# EAGLE design WideFeatherWing (EAGLE 7.4.0)
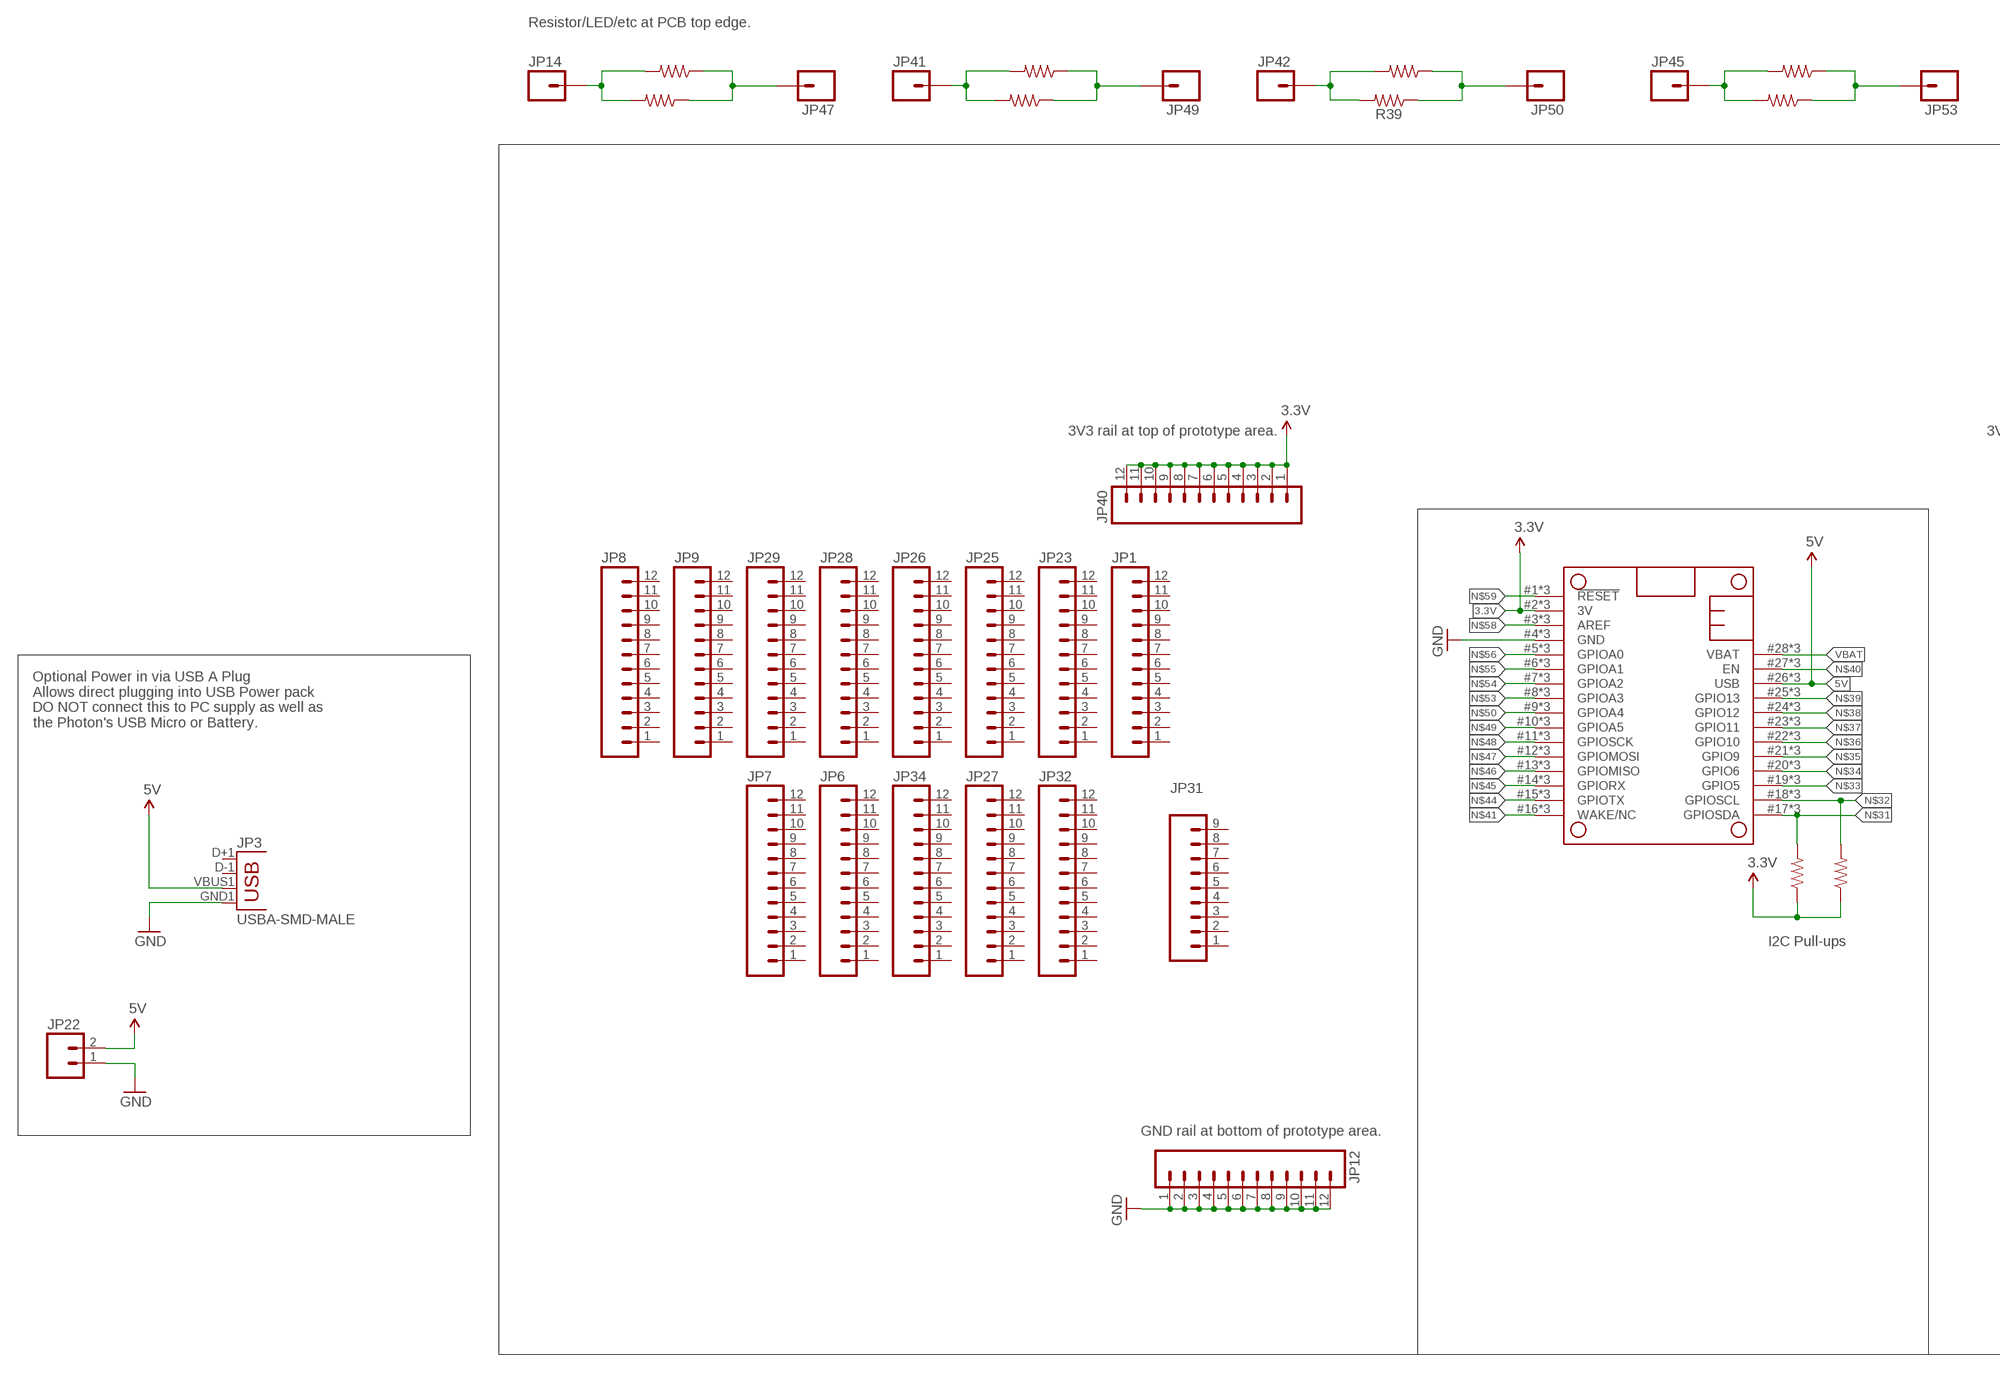
[diagram p0: schematic, sheet 1, part 1 of 2]
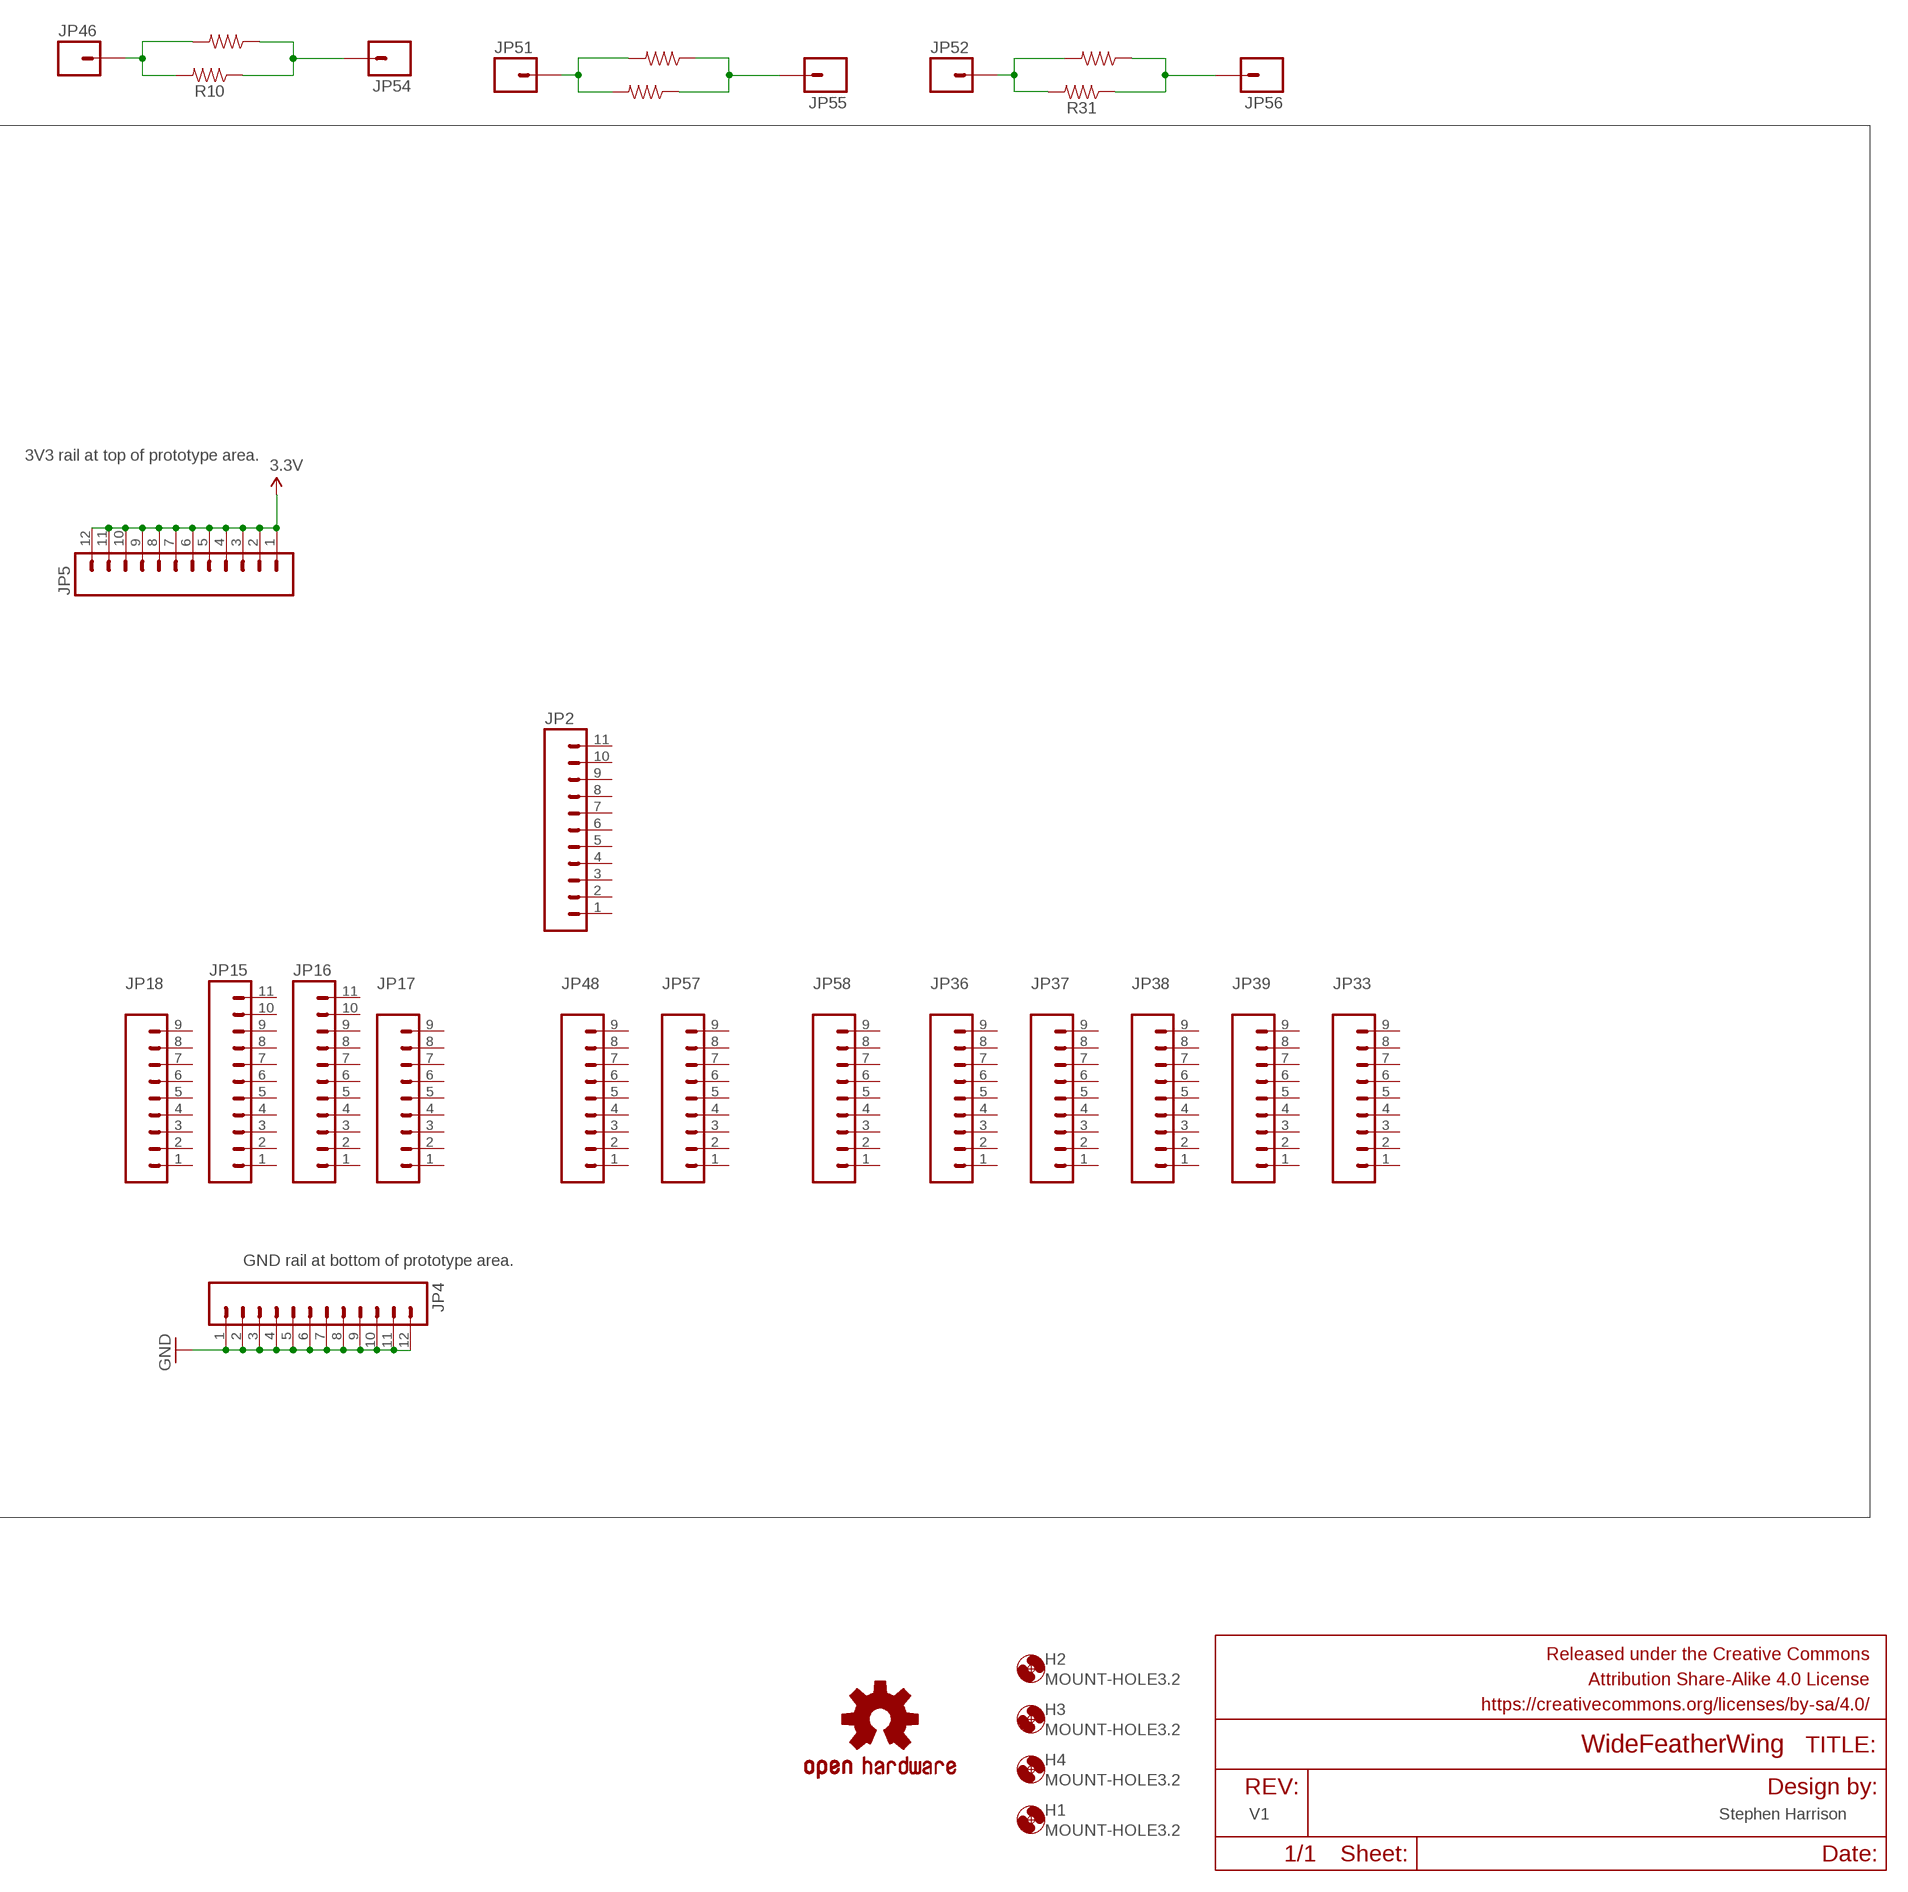
[diagram p1: schematic, sheet 1, part 2 of 2]

## Parts
FRAME1  FRAME-LEDGER  [CREATIVE_COMMONS]
H1  MOUNT-HOLE3.2  [3,2]
H2  MOUNT-HOLE3.2  [3,2]
H3  MOUNT-HOLE3.2  [3,2]
H4  MOUNT-HOLE3.2  [3,2]
JP1  M12NO_SILK  [1X12_NO_SILK]
JP2  M111X11_NO_SILK  [1X11_NO_SILK]
JP3  USBA-SMD-MALE  [USB-A-SMT-MALE]
JP4  M12PTH  [1X12]
JP5  M12PTH  [1X12]
JP6  M12NO_SILK  [1X12_NO_SILK]
JP7  M12NO_SILK  [1X12_NO_SILK]
JP8  M12NO_SILK  [1X12_NO_SILK]
JP9  M12NO_SILK  [1X12_NO_SILK]
JP12  M12PTH  [1X12]
JP14  M01PTH  [1X01]
JP15  M111X11_NO_SILK  [1X11_NO_SILK]
JP16  M111X11_NO_SILK  [1X11_NO_SILK]
JP17  M09NO_SILK  [1X09_NO_SILK]
JP18  M09NO_SILK  [1X09_NO_SILK]
JP22  M021X02_NO_SILK  [1X02_NO_SILK]
JP23  M12NO_SILK  [1X12_NO_SILK]
JP25  M12NO_SILK  [1X12_NO_SILK]
JP26  M12NO_SILK  [1X12_NO_SILK]
JP27  M12NO_SILK  [1X12_NO_SILK]
JP28  M12NO_SILK  [1X12_NO_SILK]
JP29  M12NO_SILK  [1X12_NO_SILK]
JP31  M09NO_SILK  [1X09_NO_SILK]
JP32  M12NO_SILK  [1X12_NO_SILK]
JP33  M09NO_SILK  [1X09_NO_SILK]
JP34  M12NO_SILK  [1X12_NO_SILK]
JP36  M09NO_SILK  [1X09_NO_SILK]
JP37  M09NO_SILK  [1X09_NO_SILK]
JP38  M09NO_SILK  [1X09_NO_SILK]
JP39  M09NO_SILK  [1X09_NO_SILK]
JP40  M12PTH  [1X12]
JP41  M01PTH  [1X01]
JP42  M01PTH  [1X01]
JP45  M01PTH  [1X01]
JP46  M01PTH  [1X01]
JP47  M01PTH  [1X01]
JP48  M09NO_SILK  [1X09_NO_SILK]
JP49  M01PTH  [1X01]
JP50  M01PTH  [1X01]
JP51  M01PTH  [1X01]
JP52  M01PTH  [1X01]
JP53  M01PTH  [1X01]
JP54  M01PTH  [1X01]
JP55  M01PTH  [1X01]
JP56  M01PTH  [1X01]
JP57  M09NO_SILK  [1X09_NO_SILK]
JP58  M09NO_SILK  [1X09_NO_SILK]
LOGO1  OSHW-LOGOM  [OSHW-LOGO-M]
MS1  FEATHERWINGFEATHEWING_BREAKOUT  [FEATHERWING_BREAKOUT]
R5  RESISTOR1206  [1206]
R9  RESISTOR1206  [1206]
R10  RESISTOR1206  [1206]
R17  RESISTOR1206  [1206]
R24  RESISTOR1206  [1206]
R30  RESISTOR1206  [1206]
R31  RESISTOR1206  [1206]
R32  RESISTOR1206  [1206]
R34  RESISTOR1206  [1206]
R35  RESISTOR1206  [1206]
R36  RESISTOR1206  [1206]
R37  RESISTOR1206  [1206]
R39  RESISTOR1206  [1206]
R40  RESISTOR1206  [1206]
R41  RESISTOR1206  [1206]
R44  RESISTOR1206  [1206]

## Nets
3.3V: JP5.1 JP5.2 JP5.3 JP5.4 JP5.5 JP5.6 JP5.7 JP5.8 JP5.9 JP5.10 JP5.11 JP5.12 JP40.1 JP40.2 JP40.3 JP40.4 JP40.5 JP40.6 JP40.7 JP40.8 JP40.9 JP40.10 JP40.11 JP40.12 MS1.2(3V) MS1.#2(3V) MS1.@2(3V) R5.1 R9.1
5V: JP3.VBUS1(VBUS) JP22.2 MS1.26(USB) MS1.#26(USB) MS1.@26(USB)
GND: JP3.GND1(GND) JP4.1 JP4.2 JP4.3 JP4.4 JP4.5 JP4.6 JP4.7 JP4.8 JP4.9 JP4.10 JP4.11 JP4.12 JP12.1 JP12.2 JP12.3 JP12.4 JP12.5 JP12.6 JP12.7 JP12.8 JP12.9 JP12.10 JP12.11 JP12.12 JP22.1 MS1.4(GND) MS1.#4(GND) MS1.@4(GND)
N$1: JP42.1 R39.2 R44.2
N$4: JP53.1 R17.1 R24.1
N$5: JP45.1 R17.2 R24.2
N$21: JP46.1 R10.2 R30.2
N$22: JP54.1 R10.1 R30.1
N$23: JP55.1 R32.1 R36.1
N$24: JP51.1 R32.2 R36.2
N$25: JP56.1 R31.1 R37.1
N$26: JP52.1 R31.2 R37.2
N$31: MS1.17(GPIOSDA) MS1.#17(GPIOSDA) MS1.@17(GPIOSDA) R5.2
N$32: MS1.18(GPIOSCL) MS1.#18(GPIOSCL) MS1.@!8(GPIOSCL) R9.2
N$33: MS1.19(GPIO5) MS1.#19(GPIO5) MS1.@19(GPIO5)
N$34: MS1.20(GPIO6) MS1.#20(GPIO6) MS1.@20(GPIO6)
N$35: MS1.21(GPIO9) MS1.#21(GPIO9) MS1.@21(GPIO9)
N$36: MS1.22(GPIO10) MS1.#22(GPIO10) MS1.@22(GPIO10)
N$37: MS1.23(GPIO11) MS1.#23(GPIO11) MS1.@23(GPIO11)
N$38: MS1.24(GPIO12) MS1.#24(GPIO12) MS1.@24(GPIO12)
N$39: MS1.25(GPIO13) MS1.#25(GPIO13) MS1.@25(GPIO13)
N$40: MS1.27(EN) MS1.#27(EN) MS1.@27(EN)
N$41: MS1.16(WAKE/NC) MS1.#16(WAKE/NC) MS1.@16(WAKE/NC)
N$43: JP47.1 R34.1 R35.1
N$44: MS1.15(GPIOTX) MS1.#15(GPIOTX) MS1.@15(GPIOTX)
N$45: MS1.14(GPIORX) MS1.#14(GPIORX) MS1.@14(GPIORX)
N$46: MS1.13(GPIOMISO) MS1.#13(GPIOMISO) MS1.@13(GPIOMISO)
N$47: MS1.12(GPIOMOSI) MS1.#12(GPIOMOSI) MS1.@12(GPIOMOSI)
N$48: MS1.11(GPIOSCK) MS1.#11(GPIOSCK) MS1.@11(GPIOSCK)
N$49: MS1.10(GPIOA5) MS1.#10(GPIOA5) MS1.@10(GPIOA5)
N$50: MS1.9(GPIOA4) MS1.#9(GPIOA4) MS1.@9(GPIOA4)
N$52: JP14.1 R34.2 R35.2
N$53: MS1.8(GPIOA3) MS1.#8(GPIOA3) MS1.@8(GPIOA3)
N$54: MS1.7(GPIOA2) MS1.#7(GPIOA2) MS1.@7(GPIOA2)
N$55: MS1.6(GPIOA1) MS1.#6(GPIOA1) MS1.@6(GPIOA1)
N$56: MS1.5(GPIOA0) MS1.#5(GPIOA0) MS1.@5(GPIOA0)
N$58: MS1.3(AREF) MS1.#3(AREF) MS1.@3(AREF)
N$59: MS1.1(!RESET) MS1.#1(!RESET) MS1.@1(!RESET)
N$64: JP49.1 R40.1 R41.1
N$65: JP41.1 R40.2 R41.2
N$72: JP50.1 R39.1 R44.1
VBAT: MS1.28(VBAT) MS1.#28(VBAT) MS1.@28(VBAT)
Unconnected: JP1.1 JP1.2 JP1.3 JP1.4 JP1.5 JP1.6 JP1.7 JP1.8 JP1.9 JP1.10 JP1.11 JP1.12 JP2.1 JP2.2 JP2.3 JP2.4 JP2.5 JP2.6 JP2.7 JP2.8 JP2.9 JP2.10 JP2.11 JP3.D+1(D+) JP3.D-1(D-) JP6.1 JP6.2 JP6.3 JP6.4 JP6.5 JP6.6 JP6.7 JP6.8 JP6.9 JP6.10 JP6.11 JP6.12 JP7.1 JP7.2 JP7.3 JP7.4 JP7.5 JP7.6 JP7.7 JP7.8 JP7.9 JP7.10 JP7.11 JP7.12 JP8.1 JP8.2 JP8.3 JP8.4 JP8.5 JP8.6 JP8.7 JP8.8 JP8.9 JP8.10 JP8.11 JP8.12 JP9.1 JP9.2 JP9.3 JP9.4 JP9.5 JP9.6 JP9.7 JP9.8 JP9.9 JP9.10 JP9.11 JP9.12 JP15.1 JP15.2 JP15.3 JP15.4 JP15.5 JP15.6 JP15.7 JP15.8 JP15.9 JP15.10 JP15.11 JP16.1 JP16.2 JP16.3 JP16.4 JP16.5 JP16.6 JP16.7 JP16.8 JP16.9 JP16.10 JP16.11 JP17.1 JP17.2 JP17.3 JP17.4 JP17.5 JP17.6 JP17.7 JP17.8 JP17.9 JP18.1 JP18.2 JP18.3 JP18.4 JP18.5 JP18.6 JP18.7 JP18.8 JP18.9 JP23.1 JP23.2 JP23.3 JP23.4 JP23.5 JP23.6 JP23.7 JP23.8 JP23.9 JP23.10 JP23.11 JP23.12 JP25.1 JP25.2 JP25.3 JP25.4 JP25.5 JP25.6 JP25.7 JP25.8 JP25.9 JP25.10 JP25.11 JP25.12 JP26.1 JP26.2 JP26.3 JP26.4 JP26.5 JP26.6 JP26.7 JP26.8 JP26.9 JP26.10 JP26.11 JP26.12 JP27.1 JP27.2 JP27.3 JP27.4 JP27.5 JP27.6 JP27.7 JP27.8 JP27.9 JP27.10 JP27.11 JP27.12 JP28.1 JP28.2 JP28.3 JP28.4 JP28.5 JP28.6 JP28.7 JP28.8 JP28.9 JP28.10 JP28.11 JP28.12 JP29.1 JP29.2 JP29.3 JP29.4 JP29.5 JP29.6 JP29.7 JP29.8 JP29.9 JP29.10 JP29.11 JP29.12 JP31.1 JP31.2 JP31.3 JP31.4 JP31.5 JP31.6 JP31.7 JP31.8 JP31.9 JP32.1 JP32.2 JP32.3 JP32.4 JP32.5 JP32.6 JP32.7 JP32.8 JP32.9 JP32.10 JP32.11 JP32.12 JP33.1 JP33.2 JP33.3 JP33.4 JP33.5 JP33.6 JP33.7 JP33.8 JP33.9 JP34.1 JP34.2 JP34.3 JP34.4 JP34.5 JP34.6 JP34.7 JP34.8 JP34.9 JP34.10 JP34.11 JP34.12 JP36.1 JP36.2 JP36.3 JP36.4 JP36.5 JP36.6 JP36.7 JP36.8 JP36.9 JP37.1 JP37.2 JP37.3 JP37.4 JP37.5 JP37.6 JP37.7 JP37.8 JP37.9 JP38.1 JP38.2 JP38.3 JP38.4 JP38.5 JP38.6 JP38.7 JP38.8 JP38.9 JP39.1 JP39.2 JP39.3 JP39.4 JP39.5 JP39.6 JP39.7 JP39.8 JP39.9 JP48.1 JP48.2 JP48.3 JP48.4 JP48.5 JP48.6 JP48.7 JP48.8 JP48.9 JP57.1 JP57.2 JP57.3 JP57.4 JP57.5 JP57.6 JP57.7 JP57.8 JP57.9 JP58.1 JP58.2 JP58.3 JP58.4 JP58.5 JP58.6 JP58.7 JP58.8 JP58.9

## Notes on the sheet
- Resistor/LED/etc at PCB top edge.
- 3V3 rail at top of prototype area. | 3V3 rail at top of prototype area.
- Optional Power in via USB A Plug
  Allows direct plugging into USB Power pack
  DO NOT connect this to PC supply as well as
  the Photon's USB Micro or Battery.
- I2C Pull-ups
- GND rail at bottom of prototype area. | GND rail at bottom of prototype area.
- V1 | Stephen Harrison

## Library data of the parts
FRAME1 = SparkFun-Aesthetics:FRAME-LEDGER: Schematic Frame - Ledger Standard 11x14 US Ledger frame
H1-H4 = holes:MOUNT-HOLE: MOUNTING HOLE with drill center marker
JP1 JP4-JP9 JP12 JP23 JP25-JP29 JP32 JP34 JP40 = SparkFun-Connectors:M12: Header 12 Standard 12-pin 0.1" header. Use with straight break away headers (SKU : PRT-00116), right angle break away headers (PRT-00553), swiss pins (PRT-00743), machine pins (PRT-00117), and female headers (PRT-00115).
JP2 JP15 JP16 = SparkFun-Connectors:M11: Header 11 Standard 11-pin 0.1" header. Use with straight break away headers (SKU : PRT-00116), right angle break away headers (PRT-00553), swiss pins (PRT-00743), machine pins (PRT-00117), and female headers (PRT-00115).
JP3 = SparkFun-Connectors:USB: USB Connectors USB-B-PTH is fully proven SKU : PRT-00139/CONN-08278 USB-miniB is fully proven SKU : PRT-00587 USB-A-PCB is untested. USB-A-H is throughly reviewed, but untested. Spark Fun Electronics SKU : PRT-00437 USB-B-SMT is throughly reviewed, but untested. Needs silkscreen touching up. USB-A-S has not been used/tested USB-MB-H has not been used/tested USB-MICROB has been used. CONN-09505
JP14 JP41 JP42 JP45-JP47 JP49-JP56 = SparkFun-Connectors:M01: Header 1 Standard 1-pin 0.1" header. Use with straight break away headers (SKU : PRT-00116), right angle break away headers (PRT-00553), swiss pins (PRT-00743), machine pins (PRT-00117), and female headers (PRT-00115).
JP17 JP18 JP31 JP33 JP36-JP39 JP48 JP57 JP58 = SparkFun-Connectors:M09: Header 9 Standard 9-pin 0.1" header. Use with straight break away headers (SKU : PRT-00116), right angle break away headers (PRT-00553), swiss pins (PRT-00743), machine pins (PRT-00117), and female headers (PRT-00115).
JP22 = SparkFun-Connectors:M02: Standard 2-pin 0.1" header. Use with - straight break away headers ( PRT-00116) - right angle break away headers (PRT-00553) - swiss pins (PRT-00743) - machine pins (PRT-00117) - female headers (PRT-00115) Molex polarized connector foot print use with: PRT-08233 with associated crimp pins and housings. 2.54_SCREWTERM for use with PRT-10571. 3.5mm Screw Terminal footprints for PRT-08084 5mm Screw Terminal footprints for use with PRT-08432
LOGO1 = SparkFun-Aesthetics:OSHW-LOGO: Open-Source Hardware (OSHW) Logo This logo indicates the piece of hardware it is found on incorporates a OSHW license and/or adheres to the definition of open source hardware found here: http://freedomdefined.org/OSHW
MS1 = ThingySticks:FEATHERWING
R5 R9 R10 R17 R24 R30-R32 R34-R37 R39-R41 R44 = SparkFun-Resistors:RESISTOR: Generic Resistor Package

## Board
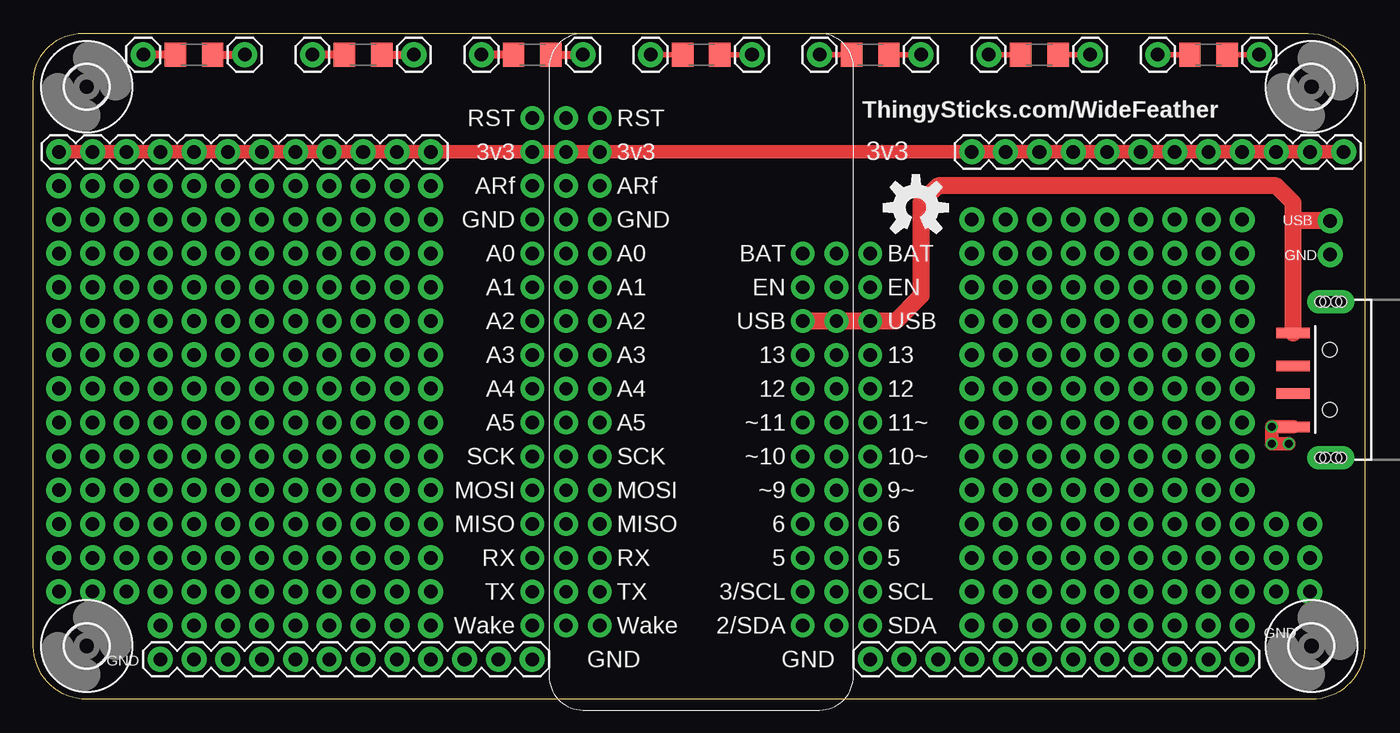
[diagram p2: board, top side]
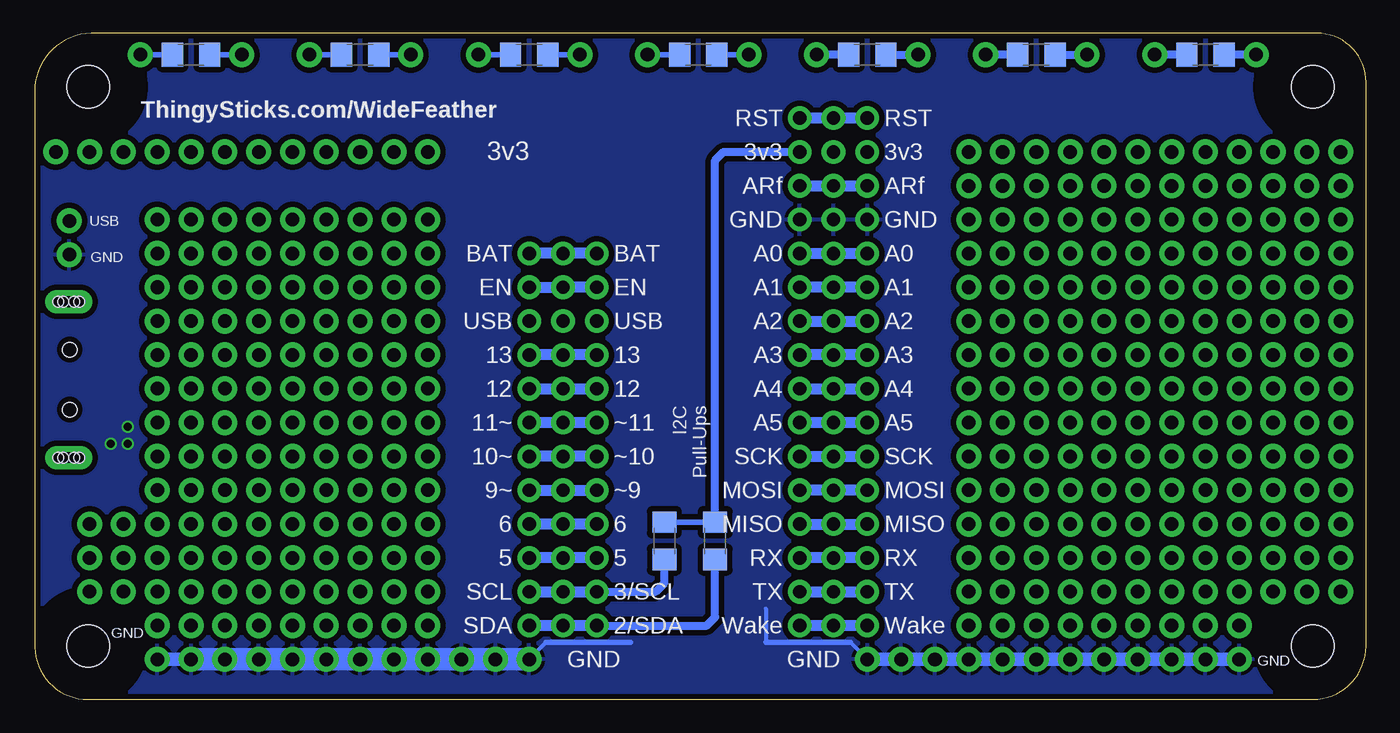
[diagram p3: board, bottom side, seen from below]

Size 100.01 x 50.01 mm. Coordinates in mm from the lower left corner, seen from the top.
Outline: 95.38,50 arc-90 100.01,46 100.01,3.9 arc-90 96.01,0 4.01,0 arc-90 0.01,4 0.01,46 arc-90 3.38,50 95.38,50
Copper layers (1*16): Top 0.035mm / dielectric 1.5mm / Bottom 0.035mm
Design rules "dirt_cheap_dirty_boards.v1": minimum track width 5mil, minimum drill 12mil, track to track 5mil, track to pad 5mil, pad to pad 5mil, via to via 5mil, smd to smd 0mil, copper to edge 10mil, drill to drill 10mil, minimum pad ring 10mil, minimum via ring 6mil, stop-mask expansion 2mil, vias tented up to drill 25mil, thermal gap 10mil

### Footprints (pad centres in the part's own frame; a part is rotated, then mirrored left to right if it is on the bottom)
3,2 = hole 3.2: 0,0
1X12_NO_SILK = drill 1.016 pad 1.88: 1 0,0; 2 2.54,0; 3 5.08,0; 4 7.62,0; 5 10.16,0; 6 12.7,0; 7 15.24,0; 8 17.78,0; 9 20.32,0; 10 22.86,0; 11 25.4,0; 12 27.94,0
1X11_NO_SILK = drill 1.016 pad 1.88: 1 0,0; 2 2.54,0; 3 5.08,0; 4 7.62,0; 5 10.16,0; 6 12.7,0; 7 15.24,0; 8 17.78,0; 9 20.32,0; 10 22.86,0; 11 25.4,0
USB-A-SMT-MALE = smd 0.8 x 2.5: D+1 1.027,-5.87; D-1 -1.027,-5.87; GND1 3.551,-5.87; VBUS1 -3.5,-5.87 | drill 0.8 pad 1.778 long: P$1 5.85,-3.05; P$3 -5.85,-3.05 | hole 1.1: 2.25,-3.12; -2.25,-3.12 | hole 0.8: -5.85,-3.45; -5.85,-3.85; -5.85,-2.65; -5.85,-2.25; 5.85,-3.45; 5.85,-3.85; 5.85,-2.65; 5.85,-2.25
1X12 = drill 1.016 pad 1.88: 1 0,0; 2 2.54,0; 3 5.08,0; 4 7.62,0; 5 10.16,0; 6 12.7,0; 7 15.24,0; 8 17.78,0; 9 20.32,0; 10 22.86,0; 11 25.4,0; 12 27.94,0
1X01 = drill 1.016 pad 1.88: 1 0,0
1X09_NO_SILK = drill 1.016 pad 1.88: 1 0,0; 2 2.54,0; 3 5.08,0; 4 7.62,0; 5 10.16,0; 6 12.7,0; 7 15.24,0; 8 17.78,0; 9 20.32,0
1X02_NO_SILK = drill 1.016 pad 1.88: 1 0,0; 2 2.54,0
FEATHERWING_BREAKOUT = drill 1 pad 1.778: 1 6.35,1.27; 2 8.89,1.27; 3 11.43,1.27; 4 13.97,1.27; 5 16.51,1.27; 6 19.05,1.27; 7 21.59,1.27; 8 24.13,1.27; 9 26.67,1.27; 10 29.21,1.27; 11 31.75,1.27; 12 34.29,1.27; 13 36.83,1.27; 14 39.37,1.27; 15 41.91,1.27; 16 44.45,1.27; 17 44.45,21.59; 18 41.91,21.59; 19 39.37,21.59; 20 36.83,21.59; 21 34.29,21.59; 22 31.75,21.59; 23 29.21,21.59; 24 26.67,21.59; 25 24.13,21.59; 26 21.59,21.59; 27 19.05,21.59; 28 16.51,21.59; #1 6.35,3.81; #2 8.89,3.81; #3 11.43,3.81; #4 13.97,3.81; #5 16.51,3.81; #6 19.05,3.81; #7 21.59,3.81; #8 24.13,3.81; #9 26.67,3.81; #10 29.21,3.81; #11 31.75,3.81; #12 34.29,3.81; #13 36.83,3.81; #14 39.37,3.81; #15 41.91,3.81; #16 44.45,3.81; #17 44.45,19.05; #18 41.91,19.05; #19 39.37,19.05; #20 36.83,19.05; #21 34.29,19.05; #22 31.75,19.05; #23 29.21,19.05; #24 26.67,19.05; #25 24.13,19.05; #26 21.59,19.05; #27 19.05,19.05; #28 16.51,19.05; @1 6.35,-1.27; @2 8.89,-1.27; @3 11.43,-1.27; @4 13.97,-1.27; @5 16.51,-1.27; @6 19.05,-1.27; @7 21.59,-1.27; @8 24.13,-1.27; @9 26.67,-1.27; @10 29.21,-1.27; @11 31.75,-1.27; @12 34.29,-1.27; @13 36.83,-1.27; @14 39.37,-1.27; @15 41.91,-1.27; @16 44.45,-1.27; @17 44.45,24.13; @19 39.37,24.13; @20 36.83,24.13; @21 34.29,24.13; @22 31.75,24.13; @23 29.21,24.13; @24 26.67,24.13; @25 24.13,24.13; @26 21.59,24.13; @27 19.05,24.13; @28 16.51,24.13; @!8 41.91,24.13
1206 = smd 1.6 x 1.8: 1 -1.4,0; 2 1.4,0

### Placement (x,y rotation side)
FRAME1  20.97,-9.7 0 top  (outside the outline)
H1  4.01,4 0 top
H2  4.01,46 0 top
H3  96.01,46 0 top
H4  96.01,4 0 top
JP1  29.86,18.24 180 top
JP2  70.5,13.16 0 top
JP3  100.51,24 270 top
JP4  62.88,3 0 top
JP5  70.5,41.1 0 top
JP6  29.86,30.94 180 top
JP7  29.86,15.7 180 top
JP8  29.86,13.16 180 top
JP9  29.86,38.56 180 top
JP12  37.48,3 180 top
JP14  33.67,48.4 90 top
JP15  70.5,10.62 0 top
JP16  70.5,8.08 0 top
JP17  70.5,5.54 0 top
JP18  70.5,28.4 0 top
JP22  97.43,33.39 90 top
JP23  29.86,23.32 180 top
JP25  29.86,20.78 180 top
JP26  29.86,33.48 180 top
JP27  29.86,36.02 180 top
JP28  29.86,28.4 180 top
JP29  29.86,25.86 180 top
JP31  70.5,15.7 0 top
JP32  29.86,10.62 180 top
JP33  29.86,5.54 180 top
JP34  29.86,8.08 180 top
JP36  70.5,25.86 0 top
JP37  70.5,23.32 0 top
JP38  70.5,20.78 0 top
JP39  70.5,18.24 0 top
JP40  29.86,41.1 180 top
JP41  20.97,48.4 90 top
JP42  8.27,48.4 0 top
JP45  46.37,48.4 0 top
JP46  79.39,48.4 0 top
JP47  41.29,48.4 90 top
JP48  70.5,30.94 0 top
JP49  28.59,48.4 90 top
JP50  15.89,48.4 0 top
JP51  92.09,48.4 0 top
JP52  66.69,48.4 0 top
JP53  53.99,48.4 0 top
JP54  71.77,48.4 0 top
JP55  84.47,48.4 0 top
JP56  59.07,48.4 0 top
JP57  70.5,33.48 0 top
JP58  70.5,36.02 0 top
LOGO1  66.31,36.92 0 top
MS1  38.75,49.99 270 top
R5  48.91,11.89 270 bottom
R9  52.72,11.89 270 bottom
R10  75.58,48.4 0 top
R17  50.18,48.4 180 top
R24  50.18,48.4 0 bottom
R30  75.58,48.4 180 bottom
R31  62.88,48.4 180 bottom
R32  88.28,48.4 180 bottom
R34  37.48,48.4 180 top
R35  37.48,48.4 0 bottom
R36  88.28,48.4 0 top
R37  62.88,48.4 0 top
R39  12.08,48.4 180 top
R40  24.78,48.4 180 top
R41  24.78,48.4 0 bottom
R44  12.08,48.4 0 bottom

### Tracks (layer width: path | path; a pad name or v marks a point on that pad's centre or on a via)
3.3V
  Top 1.016: JP40.12 JP40.11 JP40.10 JP40.9 JP40.8 JP40.7 JP40.6 JP40.5 JP40.4 JP40.3 JP40.2 JP40.1 MS1.@2 MS1.2 MS1.#2 JP5.2 | JP5.12 JP5.11 JP5.10 JP5.9 JP5.8 JP5.7 JP5.6 JP5.5 JP5.4 JP5.3 JP5.2 | JP5.2 JP5.1
  Bottom 0.406: R5.1 R9.1
  Bottom 0.61: R5.1 48.91,40.47 48.27,41.1 MS1.#2
5V
  Top 1.27: JP3.VBUS1 94.64,36.02 | 94.64,36.02 94.64,37.27 93.36,38.56 67.96,38.56 66.69,37.29 66.69,30.3 64.78,28.4 MS1.@26 MS1.26 MS1.#26 | JP22.2 94.74,35.92 94.64,36.02
GND  (via drill 0.6)
  Top 1.016: v94.31,19.19 v93.04,19.19 v93.04,20.46 94.63,20.46 JP3.GND1
  Bottom 0.305: 61.61,4.27 JP4.1 | 45.1,6.81 45.1,4.27 | 38.75,4.27 JP12.1
  Bottom 0.406: 55.26,4.27 61.61,4.27 | 45.1,4.27 38.75,4.27
  Bottom 1.016: JP12.1 JP12.2 JP12.3 JP12.4 JP12.5 JP12.6 JP12.7 JP12.8 JP12.9 JP12.10 JP12.11 JP12.12 | JP4.11 JP4.12
  Bottom 1.676: JP4.1 JP4.2 JP4.3 JP4.4 JP4.5 JP4.6 JP4.7 JP4.8 JP4.9 JP4.10 JP4.11
  pour Bottom (isolate 0.406): -0.62,-0.17 100.34,-0.17 100.54,51.66 -0.42,51.66
N$1
  Top 0.61: R44.2 JP42.1
  Bottom 0.61: JP42.1 R44.2
N$4
  Top 0.406: R24.1 JP53.1
  Bottom 0.406: R24.1 JP53.1
N$5
  Top 0.406: R17.2 JP45.1
  Bottom 0.406: R17.2 JP45.1
N$21
  Top 0.406: JP46.1 R10.2
  Bottom 0.406: R10.2 JP46.1
N$22
  Top 0.406: JP54.1 R30.1
  Bottom 0.406: R30.1 JP54.1
N$23
  Top 0.406: JP55.1 R36.1
  Bottom 0.406: R36.1 JP55.1
N$24
  Top 0.406: JP51.1 R32.2
  Bottom 0.406: R32.2 JP51.1
N$25
  Top 0.406: JP56.1 R37.1
  Bottom 0.406: R37.1 JP56.1
N$26
  Top 0.406: JP52.1 R37.2
  Bottom 0.406: R37.2 JP52.1
N$31
  Bottom 0.61: MS1.#17 49.54,5.54 48.91,6.17 R5.2
  Bottom 0.813: MS1.#17 MS1.17 MS1.@17
N$32
  Bottom 0.61: MS1.#18 53.35,8.08 52.72,8.71 R9.2
  Bottom 0.813: MS1.@!8 MS1.18 MS1.#18
N$33
  Bottom 0.813: MS1.#19 MS1.19 MS1.@19
N$34
  Bottom 0.813: MS1.#20 MS1.20 MS1.@20
N$35
  Bottom 0.813: MS1.@21 MS1.21 MS1.#21
N$36
  Bottom 0.813: MS1.#22 MS1.22 MS1.@22
N$37
  Bottom 0.813: MS1.#23 MS1.23 MS1.@23
N$38
  Bottom 0.813: MS1.@24 MS1.24 MS1.#24
N$39
  Bottom 0.813: MS1.#25 MS1.25 MS1.@25
N$40
  Bottom 0.813: MS1.@27 MS1.27 MS1.#27
N$41
  Bottom 0.813: MS1.@16 MS1.16 MS1.#16
N$43
  Top 0.61: R35.1 JP47.1
  Bottom 0.61: R35.1 JP47.1
N$44
  Bottom 0.813: MS1.#15 MS1.15 MS1.@15
N$45
  Bottom 0.813: MS1.@14 MS1.14 MS1.#14
N$46
  Bottom 0.813: MS1.#13 MS1.13 MS1.@13
N$47
  Bottom 0.813: MS1.@12 MS1.12 MS1.#12
N$48
  Bottom 0.813: MS1.#11 MS1.11 MS1.@11
N$49
  Bottom 0.813: MS1.@10 MS1.10 MS1.#10
N$50
  Bottom 0.813: MS1.#9 MS1.9 MS1.@9
N$52
  Top 0.61: R34.2 JP14.1
  Bottom 0.61: R34.2 JP14.1
N$53
  Bottom 0.813: MS1.@8 MS1.8 MS1.#8
N$54
  Bottom 0.813: MS1.#7 MS1.7 MS1.@7
N$55
  Bottom 0.813: MS1.@6 MS1.6 MS1.#6
N$56
  Bottom 0.813: MS1.#5 MS1.5 MS1.@5
N$58
  Bottom 0.813: MS1.#3 MS1.3 MS1.@3
N$59
  Bottom 0.813: MS1.@1 MS1.1 MS1.#1
N$64
  Top 0.61: R41.1 JP49.1
  Bottom 0.61: R41.1 JP49.1
N$65
  Top 0.61: R40.2 JP41.1
  Bottom 0.61: R40.2 JP41.1
N$72
  Top 0.61: R44.1 JP50.1
  Bottom 0.61: R44.1 JP50.1
VBAT
  Bottom 0.813: MS1.#28 MS1.28 MS1.@28

### Text on the board
tNames: ThingySticks.com/WideFeather | 3v3 | USB | GND | GND | GND | GND | GND
bNames: ThingySticks.com/WideFeather | 3v3 | USB | GND | I2C / Pull-Ups | GND | GND | GND | GND
Document: Stephen Harrison